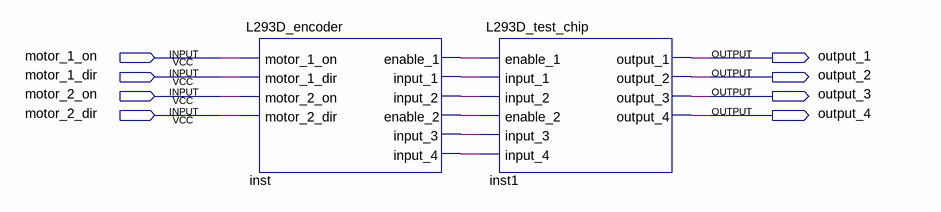
[diagram p0: schematic sheet]
// Quartus schematic motor_simple_test.bdf as structural Verilog: 2 symbols, 8 pins
module motor_simple_test (
  input  motor_1_on,
  input  motor_1_dir,
  input  motor_2_on,
  input  motor_2_dir,
  output output_1,
  output output_2,
  output output_3,
  output output_4
);

  wire inst_enable_1, inst_enable_2, inst_input_1, inst_input_2, inst_input_3, inst_input_4;

  L293D_encoder inst (
    .motor_1_on(motor_1_on), .motor_1_dir(motor_1_dir), .motor_2_on(motor_2_on), .motor_2_dir(motor_2_dir),
    .enable_1(inst_enable_1), .input_1(inst_input_1), .input_2(inst_input_2), .enable_2(inst_enable_2),
    .input_3(inst_input_3), .input_4(inst_input_4));
  L293D_test_chip inst1 (
    .enable_1(inst_enable_1), .input_1(inst_input_1), .input_2(inst_input_2), .enable_2(inst_enable_2),
    .input_3(inst_input_3), .input_4(inst_input_4), .output_1(output_1), .output_2(output_2),
    .output_3(output_3), .output_4(output_4));
endmodule
